# EAGLE design conbrio pots board 11-1-21 (EAGLE 9.6.2)
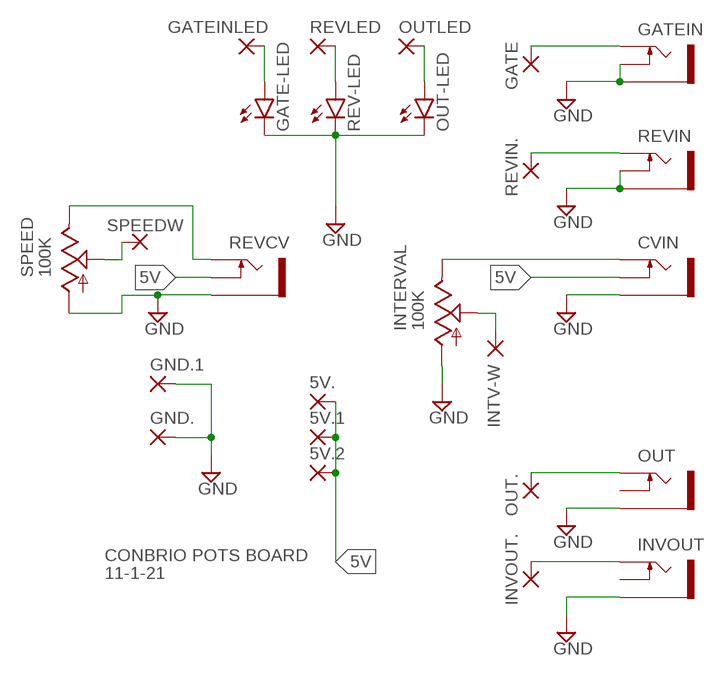
[diagram p0: schematic, sheet 1]

## Parts
5V.  WIREPAD3,17/1,3  [3,17/1,3]
5V.1  WIREPAD3,17/1,3  [3,17/1,3]
5V.2  WIREPAD3,17/1,3  [3,17/1,3]
CVIN  THONKICONNNEW  [WQP-PJ301M-12_JACK]
GATE  WIREPAD3,17/1,3  [3,17/1,3]
GATE-LED  LED3MM  [LED3MM]
GATEIN  THONKICONNNEW  [WQP-PJ301M-12_JACK]
GATEINLED  WIREPAD3,17/1,3  [3,17/1,3]
GND.  WIREPAD3,17/1,3  [3,17/1,3]
GND.1  WIREPAD3,17/1,3  [3,17/1,3]
INTERVAL  100K  9MM_SNAP-IN_POT_  [9MM_SNAP-IN_POT]
INTV-W  WIREPAD3,17/1,3  [3,17/1,3]
INVOUT  THONKICONNNEW  [WQP-PJ301M-12_JACK]
INVOUT.  WIREPAD3,17/1,3  [3,17/1,3]
OUT  THONKICONNNEW  [WQP-PJ301M-12_JACK]
OUT-LED  LED3MM  [LED3MM]
OUT.  WIREPAD3,17/1,3  [3,17/1,3]
OUTLED  WIREPAD3,17/1,3  [3,17/1,3]
REV-LED  LED3MM  [LED3MM]
REVCV  THONKICONNNEW  [WQP-PJ301M-12_JACK]
REVIN  THONKICONNNEW  [WQP-PJ301M-12_JACK]
REVIN.  WIREPAD3,17/1,3  [3,17/1,3]
REVLED  WIREPAD3,17/1,3  [3,17/1,3]
SPEED  100K  9MM_SNAP-IN_POT_  [9MM_SNAP-IN_POT]
SPEEDW  WIREPAD3,17/1,3  [3,17/1,3]

## Nets
5V: 5V.1.1(P) 5V.2.1(P) 5V..1(P) CVIN.P$2_SWITCH(SWITCH) REVCV.P$2_SWITCH(SWITCH)
GND: CVIN.P$3_SLEEVE(SLEEVE) GATE-LED.K(C) GATEIN.P$2_SWITCH(SWITCH) GATEIN.P$3_SLEEVE(SLEEVE) GND.1.1(P) GND..1(P) INTERVAL.1(A) INVOUT.P$3_SLEEVE(SLEEVE) OUT-LED.K(C) OUT.P$3_SLEEVE(SLEEVE) REV-LED.K(C) REVCV.P$3_SLEEVE(SLEEVE) REVIN.P$2_SWITCH(SWITCH) REVIN.P$3_SLEEVE(SLEEVE) SPEED.1(A)
N$1: GATE-LED.A GATEINLED.1(P)
N$2: REV-LED.A REVLED.1(P)
N$3: OUT-LED.A OUTLED.1(P)
N$4: CVIN.P$1_TIP(TIP) INTERVAL.3(E)
N$5: INTERVAL.2(S) INTV-W.1(P)
N$6: REVCV.P$1_TIP(TIP) SPEED.3(E)
N$7: SPEED.2(S) SPEEDW.1(P)
N$8: GATE.1(P) GATEIN.P$1_TIP(TIP)
N$9: REVIN..1(P) REVIN.P$1_TIP(TIP)
N$10: OUT..1(P) OUT.P$1_TIP(TIP)
N$11: INVOUT..1(P) INVOUT.P$1_TIP(TIP)
Unconnected: INVOUT.P$2_SWITCH(SWITCH) OUT.P$2_SWITCH(SWITCH)

## Notes on the sheet
- CONBRIO POTS BOARD
- 11-1-21

## Library data of the parts
5V. 5V.1 5V.2 GATE GATEINLED GND. GND.1 INTV-W INVOUT. OUT. OUTLED REVIN. REVLED SPEEDW = wirepad:WIREPAD: Wire PAD connect wire on PCB
CVIN GATEIN INVOUT OUT REVCV REVIN = MusicThingModular:THONKICONN: 3.5mm socket for Eurorack modular synths
GATE-LED OUT-LED REV-LED = led:LED: LED OSRAM: - CHIPLED LG R971, LG N971, LY N971, LG Q971, LY Q971, LO R971, LY R971 LH N974, LH R974 LS Q976, LO Q976, LY Q976 LO Q996 - Hyper CHIPLED LW Q18S LB Q993, LB Q99A, LB R99A - SideLED LS A670, LO A670, LY A670, LG A670, LP A670 LB A673, LV A673, LT A673, LW A673 LH A674 LY A675 LS A676, LA A676, LO A676, LY A676, LW A676 LS A679, LY A679, LG A679 - Hyper Micro SIDELED® LS Y876, LA Y876, LO Y876, LY Y876 LT Y87S - SmartLED LW L88C, LW L88S LB L89C, LB L89S, LG L890 LS L89K, LO L89K, LY L89K LS L896, LA L896, LO L896, LY L896 - TOPLED LS T670, LO T670, LY T670, LG T670, LP T670 LSG T670, LSP T670, LSY T670, LOP T670, LYG T670 LG T671, LOG T671, LSG T671 LB T673, LV T673, LT T673, LW T673 LH T674 LS T676, LA T676, LO T676, LY T676, LB T676, LH T676, LSB T676, LW T676 LB T67C, LV T67C, LT T67C, LS T67K, LO T67K, LY T67K, LW E67C LS E67B, LA E67B, LO E67B, LY E67B, LB E67C, LV E67C, LT E67C LW T67C LS T679, LY T679, LG T679 LS T770, LO T770, LY T770, LG T770, LP T770 LB T773, LV T773, LT T773, LW T773 LH T774 LS E675, LA E675, LY E675, LS T675 LS T776, LA T776, LO T776, LY T776, LB T776 LHGB T686 LT T68C, LB T68C - Hyper Mini TOPLED® LB M676 - Mini TOPLED Santana® LG M470 LS M47K, LO M47K, LY M47K Source: http://www.osram.convergy.de LUXEON: - LUMILED® LXK2-PW12-R00, LXK2-PW12-S00, LXK2-PW14-U00, LXK2-PW14-V00 LXK2-PM12-R00, LXK2-PM12-S00, LXK2-PM14-U00 LXK2-PE12-Q00, LXK2-PE12-R00, LXK2-PE12-S00, LXK2-PE14-T00, LXK2-PE14-U00 LXK2-PB12-K00, LXK2-PB12-L00, LXK2-PB12-M00, LXK2-PB14-N00, LXK2-PB14-P00, LXK2-PB14-Q00 LXK2-PR12-L00, LXK2-PR12-M00, LXK2-PR14-Q00, LXK2-PR14-R00 LXK2-PD12-Q00, LXK2-PD12-R00, LXK2-PD12-S00 LXK2-PH12-R00, LXK2-PH12-S00 LXK2-PL12-P00, LXK2-PL12-Q00, LXK2-PL12-R00 Source: www.luxeon.com KINGBRIGHT: KA-3528ASYC Source: www.kingbright.com
INTERVAL SPEED = MusicThingModular-CL:9MM_SNAP-IN_POT: 9mm vertical snap-in pot, Alpha / Panasonic style

## Board
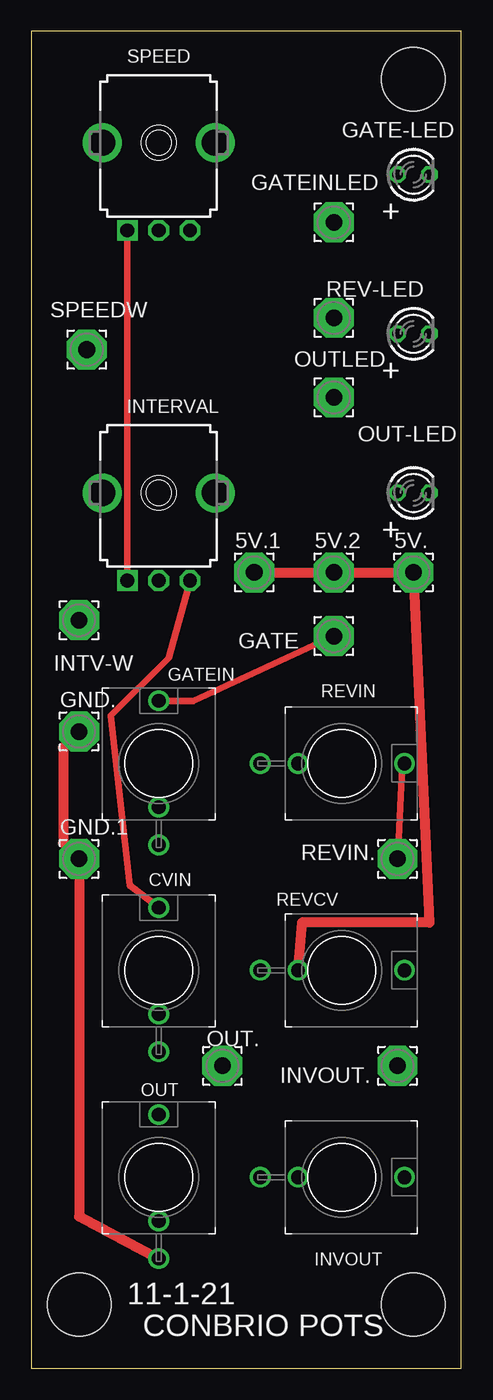
[diagram p1: board, top side]
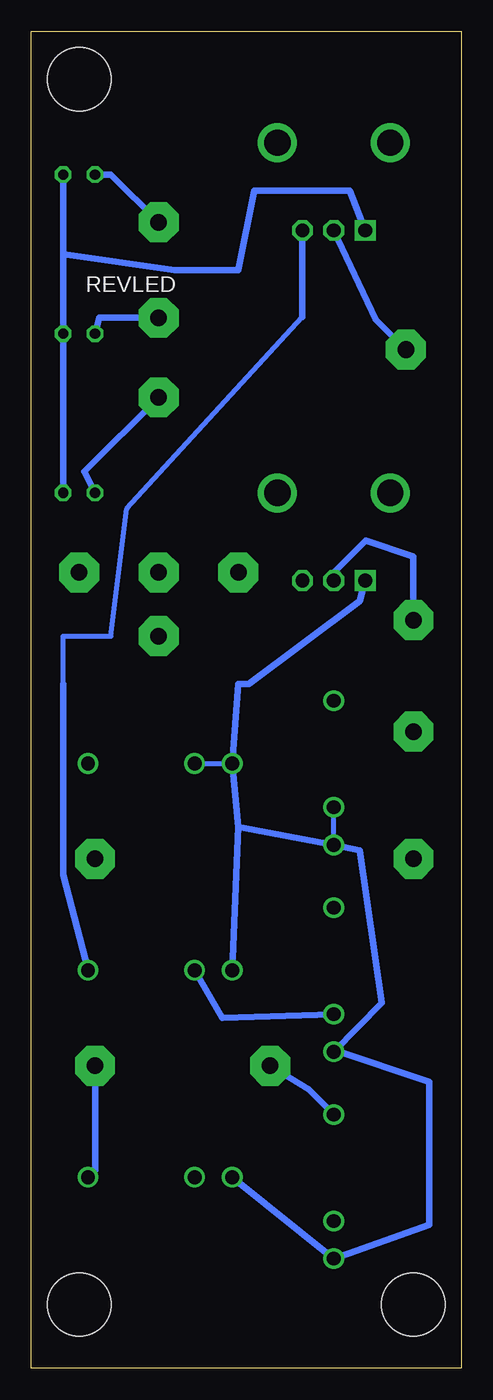
[diagram p2: board, bottom side, seen from below]

Size 34.29 x 106.68 mm. Coordinates in mm from the lower left corner, seen from the top.
Outline: 0,0 34.29,0 34.29,106.68 0,106.68 0,0
Copper layers (1*16): Top 0.035mm / dielectric 1.5mm / Bottom 0.035mm
Design rules "default": minimum track width 6mil, minimum drill 0.35mm, track to track 6mil, track to pad 6mil, pad to pad 6mil, via to via 6mil, smd to smd 6mil, copper to edge 40mil, drill to drill 6mil, minimum pad ring 10mil, minimum via ring 8mil, stop-mask expansion 4mil, vias tented up to drill 0mil, thermal gap 10mil
Holes 5.08 mm at 3.81,5.08 30.48,102.87 30.48,5.08

### Footprints (pad centres in the part's own frame; a part is rotated, then mirrored left to right if it is on the bottom)
3,17/1,3 = drill 1.321 pad 3.175 octagon: 1 0,0
WQP-PJ301M-12_JACK = drill 1.1: P$1_TIP 0,5; P$2_SWITCH 0,-3.5; P$3_SLEEVE 0,-6.5
LED3MM = drill 0.813 octagon: A -1.27,0; K 1.27,0
9MM_SNAP-IN_POT = drill 1.1 square: 1 -2.5,-7 | drill 1.1 octagon: 2 0,-7; 3 2.5,-7 | drill 2.1 pad 2.794: CHASSIS1 -4.5,0; CHASSIS2 4.5,0

### Placement (x,y rotation side)
5V.  30.48,63.5 0 top
5V.1  17.78,63.5 0 top
5V.2  24.13,63.5 0 top
CVIN  10.16,31.75 0 top
GATE  24.13,58.42 0 top
GATE-LED  30.48,95.25 0 top
GATEIN  10.16,48.26 0 top
GATEINLED  24.13,91.44 0 top
GND.  3.81,50.8 0 top
GND.1  3.81,40.64 0 top
INTERVAL  10.16,69.85 0 top
INTV-W  3.81,59.69 0 top
INVOUT  24.77,15.24 270 top
INVOUT.  29.21,24.13 180 top
OUT  10.16,15.24 0 top
OUT-LED  30.48,69.85 0 top
OUT.  15.24,24.13 0 top
OUTLED  24.13,77.47 0 top
REV-LED  30.48,82.55 0 top
REVCV  24.77,31.75 270 top
REVIN  24.77,48.26 270 top
REVIN.  29.21,40.64 90 top
REVLED  24.13,83.82 0 top
SPEED  10.16,97.79 0 top
SPEEDW  4.42,81.28 90 top

### Tracks (layer width: path | path; a pad name or v marks a point on that pad's centre or on a via)
5V
  Top 0.813: 5V.1.1 5V.2.1 5V..1 31.75,35.56 21.59,35.56 REVCV.P$2_SWITCH
  Bottom 0.508: CVIN.P$2_SWITCH 19.05,27.94 REVCV.P$2_SWITCH
GND
  Top 0.508: INTERVAL.1 7.66,78.31 7.67,78.34 7.66,78.37 SPEED.1
  Top 0.813: GND..1 2.54,49.53 2.54,41.91 GND.1.1 3.81,12.1 OUT.P$3_SLEEVE
  Bottom 0.406: GATEIN.P$3_SLEEVE GATEIN.P$2_SWITCH | REVIN.P$2_SWITCH REVIN.P$3_SLEEVE
  Bottom 0.508: GATE-LED.K 31.75,88.9 | 31.75,88.9 REV-LED.K OUT-LED.K | 31.75,88.9 22.86,87.63 17.78,87.63 16.51,93.98 8.89,93.98 SPEED.1 | 17.78,43.18 REVIN.P$3_SLEEVE 17.78,54.61 16.93,54.61 8.11,61.23 INTERVAL.1 | 17.78,43.18 GATEIN.P$3_SLEEVE 8.08,41.3 6.34,29.16 CVIN.P$3_SLEEVE 10.16,25.4 2.54,22.86 2.54,11.43 OUT.P$3_SLEEVE INVOUT.P$3_SLEEVE | 17.78,43.18 REVCV.P$3_SLEEVE
N$1
  Bottom 0.508: GATE-LED.A 27.94,95.25 GATEINLED.1
N$2
  Bottom 0.508: REV-LED.A 28.89,83.82 REVLED.1
N$3
  Bottom 0.508: OUTLED.1 30.06,71.54 OUT-LED.A
N$4
  Top 0.508: CVIN.P$1_TIP 7.86,38.51 6.35,52.07 10.94,56.66 INTERVAL.3
N$5
  Bottom 0.508: INTV-W.1 3.81,64.77 7.62,66.04 10.16,63.5 INTERVAL.2
N$6
  Bottom 0.406: 31.75,54.61 31.75,58.42 27.94,58.42 26.67,68.58 12.66,83.88
  Bottom 0.508: REVCV.P$1_TIP 31.75,39.37 31.75,54.61 | 12.66,83.88 SPEED.3
N$7
  Bottom 0.508: SPEED.2 6.82,83.68 SPEEDW.1
N$8
  Top 0.508: GATE.1 12.92,53.26 GATEIN.P$1_TIP
N$9
  Top 0.508: REVIN.P$1_TIP 29.59,48.09 REVIN..1
N$10
  Bottom 0.508: OUT..1 12.17,22.25 OUT.P$1_TIP
N$11
  Bottom 0.508: INVOUT.P$1_TIP 29.21,15.8 INVOUT..1

### Text on the board
tNames: + | + | + | 11-1-21 | CONBRIO POTS